# EasyEDA schematic SCH_Lanchester-Mower_2024-05-06 (1).json
TITLE: Mower Controller; REV: 1.0; Date: 2024-05-02; Sheet: 1/1; Drawn By: Aidan Hedley; Company: HomeStudio
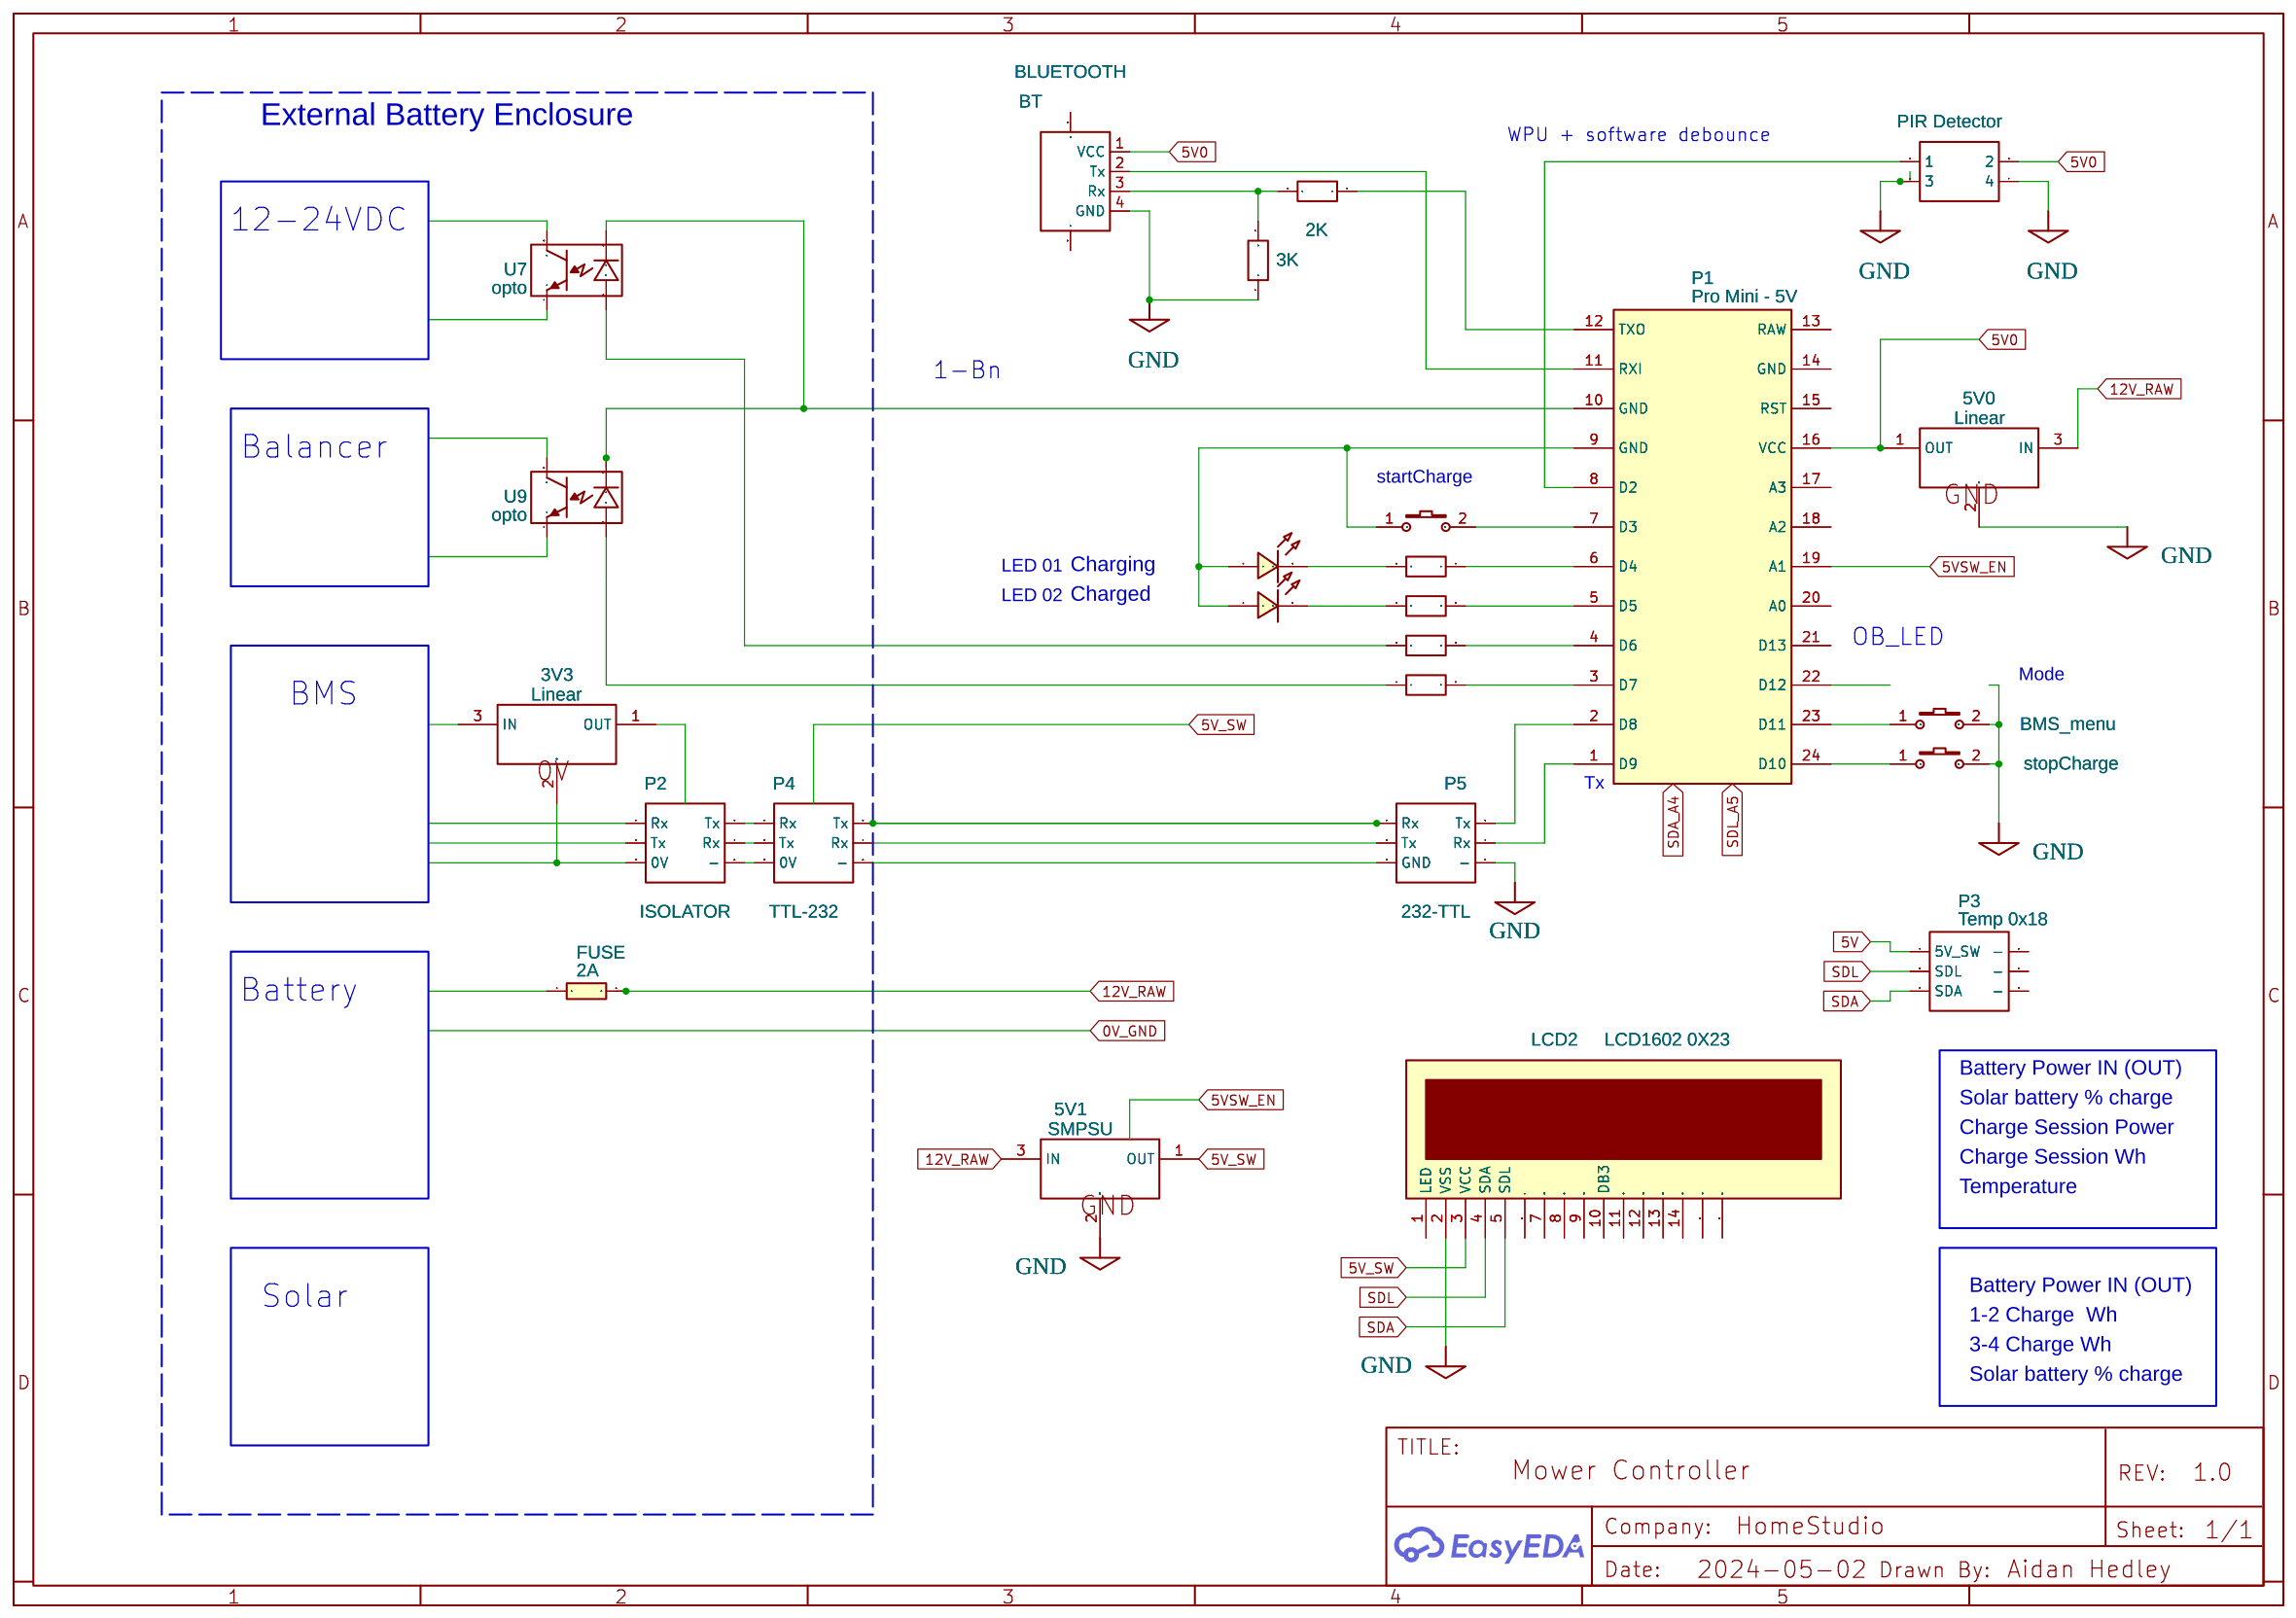
[diagram p0: schematic sheet]

## Parts
1R  2K  [R0603]
3V3  Linear  [SOT-89-3_L4.5-W2.5-P1.50-LS4.2-BR]
4R  3K  [R0603]
5R  R2  [R0603]
5V0  Linear  [SOT-89-3_L4.5-W2.5-P1.50-LS4.2-BR]
5V1  SMPSU  [SOT-89-3_L4.5-W2.5-P1.50-LS4.2-BR]
12R  R2  [R0603]
14R  R2  [R0603]
15R  R2  [R0603]
BLUETOOTH  BT  [USB-A-TH_48037-0001]
FUSE  2A  [L0603]
J2  PIR Detector  [HDR-M-2.54_2X2]
KEY1  stopCharge  [KEY-SMD_2P-L6.2-W3.6-LS8.0]
KEY3  BMS_menu  [KEY-SMD_2P-L6.2-W3.6-LS8.0]
KEY4  Start_Charge  [KEY-SMD_2P-L6.2-W3.6-LS8.0]
LCD2  LCD1602 0X23  [LCD1602]
LED1  LED-0603_R  [LED0603_RED]
LED3  LED-0603_R  [LED0603_RED]
P1  Pro Mini - 5V  [PRO MICRO - 5V]
P2  ISOLATOR  [IDC-TH_6P-P2.54_C11214]
P3  Temp 0x18  [IDC-TH_6P-P2.54_C11214]
P4  TTL-232  [IDC-TH_6P-P2.54_C11214]
P5  232-TTL  [IDC-TH_6P-P2.54_C11214]
U7  opto  [OPTO-TH_OPB841L55]
U9  opto  [OPTO-TH_OPB841L55]

## Library data of the parts
1R 4R 5R 12R 14R 15R = 贴片电阻CHIPRESISTORS: Contributor: lcsc; Supplier: LCSC; Supplier Part: C9900014833; Manufacturer: null; Manufacturer Part: 贴片电阻ChipResistors; JLCPCB Part Class: Extended Part; link: https://lcsc.com/eda_search?q=C9900014833&%26type=1&ref=editor; Package Display: No
3V3 5V0 5V1 = 7805(SOT-89): Supplier: LCSC; Manufacturer: CJ; Manufacturer Part: CJ78L05; image: //image.lceda.cn/szlcsc/C2079.jpg; Supplier Part: C2079; Paste Type: expand; Contributor: LCEDA_Lib
BLUETOOTH = USB-Type A_Male: Supplier Part: C112454; Supplier: LCSC; Manufacturer: SOFNG; Manufacturer Part: USB-05; Contributor: LCEDA_Lib
FUSE = L0603_EU: Contributor: LCEDA_Lib
J2 = HDR-M-2.54_2x2: Supplier Part: C66690; Supplier: LCSC; Contributor: LCEDA_Lib
KEY1 KEY3 KEY4 = K2-3.6×6.1_SMD: Supplier Part: C118141; Supplier: LCSC; Manufacturer Part: K2-1107ST-A4SW-06; Contributor: LCEDA_Lib; 制造商: 韩国韩荣
LCD2 = LCD1602: Manufacturer: LONTECH(厦门龙特); Manufacturer Part: LCM1602K-NSW-BBW; Supplier Part: C83275; Supplier: LCSC; Contributor: LCEDA_Lib
LED1 LED3 = LED-0603_R: Manufacturer: EVERLIGHT(台湾亿光); Manufacturer Part: 19-217/R6C-AL1M2VY/3T; Supplier Part: C72044; Supplier: LCSC; Contributor: LCEDA_01
P1 = Pro Micro - 5V - large: sourceId: 1T5FDZYC8; Contributor: Aidan Hedley
P2-P5 = HDR-IDC-2.54-2X3P: Supplier: LCSC; Manufacturer: BOOMELE; Manufacturer Part: 2X3 2.54mm IDC Box; image: //image.lceda.cn/szlcsc/C11214.jpg; Supplier Part: C11214
U7 U9 = OPB841L55: Contributor: lcsc; Supplier: LCSC; Supplier Part: C3656363; Manufacturer: OPTEK

## Nets
5V: P3.1(5V_SW)
5V0: 5V0.1(OUT) BLUETOOTH.1(VCC) J2.2 P1.16(VCC)
5V_SW: 5V1.1(OUT) LCD2.3(VCC)
5VSW_EN: P1.19(A1)
12V_RAW: 5V0.3(IN) 5V1.3(IN) FUSE.2
GND: 4R.1 5V0.2(GND) 5V1.2(GND) BLUETOOTH.4(GND) J2.3 J2.4 KEY1.2 KEY3.2 LCD2.2(VSS) P5.6(-)
SDA: LCD2.5(SDL) P3.5(SDA)
SDL: LCD2.4(SDA) P3.3(SDL)
Net-(1R-1): 1R.1 P1.12(TXO)
Net-(1R-2): 1R.2 4R.2 BLUETOOTH.3(Rx)
Net-(3V3-2): 3V3.2(GND) P2.5(0V)
Net-(5R-1): 5R.1 P1.6(D4)
Net-(5R-2): 5R.2 LED3.2
Net-(12R-1): 12R.1 LED1.2
Net-(12R-2): 12R.2 P1.5(D5)
Net-(14R-1): 14R.1 U7.2
Net-(14R-2): 14R.2 P1.4(D6)
Net-(15R-1): 15R.1 U9.2
Net-(15R-2): 15R.2 P1.3(D7)
Net-(BLUETOOTH-2): BLUETOOTH.2(Tx) P1.11(RXI)
Net-(J2-1): J2.1 P1.8(D2)
Net-(KEY1-1): KEY1.1 P1.24(D10)
Net-(KEY3-1): KEY3.1 P1.23(D11)
Net-(KEY4-1): KEY4.1 LED1.1 LED3.1 P1.9(GND)
Net-(KEY4-2): KEY4.2 P1.7(D3)
Net-(P1-1): P1.1(D9) P5.4(Rx)
Net-(P1-2): P1.2(D8) P5.2(Tx)
Net-(P1-10): P1.10(GND) U7.1 U9.1
Net-(P2-2): P2.2(Tx) P4.1(Rx)
Net-(P2-4): P2.4(Rx) P4.3(Tx)
Net-(P2-6): P2.6(-) P4.5(0V)
Net-(P4-2): P4.2(Tx) P5.1(Rx)
Net-(P4-4): P4.4(Rx) P5.3(Tx)
Net-(P4-6): P4.6(-) P5.5(GND)

Not connected (* = marked no-connect by the designer): 3V3 1(OUT) 3(IN); BLUETOOTH 5 6; FUSE 1; LCD2 1(LED) 6(E) 7(DB0) 8(DB1) 9(DB2) 10(DB3) 11(DB4) 12(DB5) 13(DB6) 14(DB7) 15(LED) 16(BLK); P1 13(RAW) 14(GND) 15(RST) 17(A3) 18(A2) 20(A0) 21(D13) 22(D12); P2 1(Rx) 3(Tx); P3 2(-) 4(-) 6(-); U7 3 4; U9 3 4

## Notes on the sheet
- External Battery Enclosure
- WPU + software debounce
- 12-24VDC
- 1-Bn
- Balancer
- startCharge
- Charging
- LED 01
- LED 02
- Charged
- OB_LED
- Mode
- BMS
- Tx
- Battery
- Battery Power IN (OUT)
- Solar battery % charge
- Charge Session Power
- Charge Session Wh
- Temperature
- Solar
- Battery Power IN (OUT)
- 1-2 Charge  Wh
- 3-4 Charge Wh
- Solar battery % charge
